# Altium schematic sheet mainSchem.SchDoc
size Tabloid
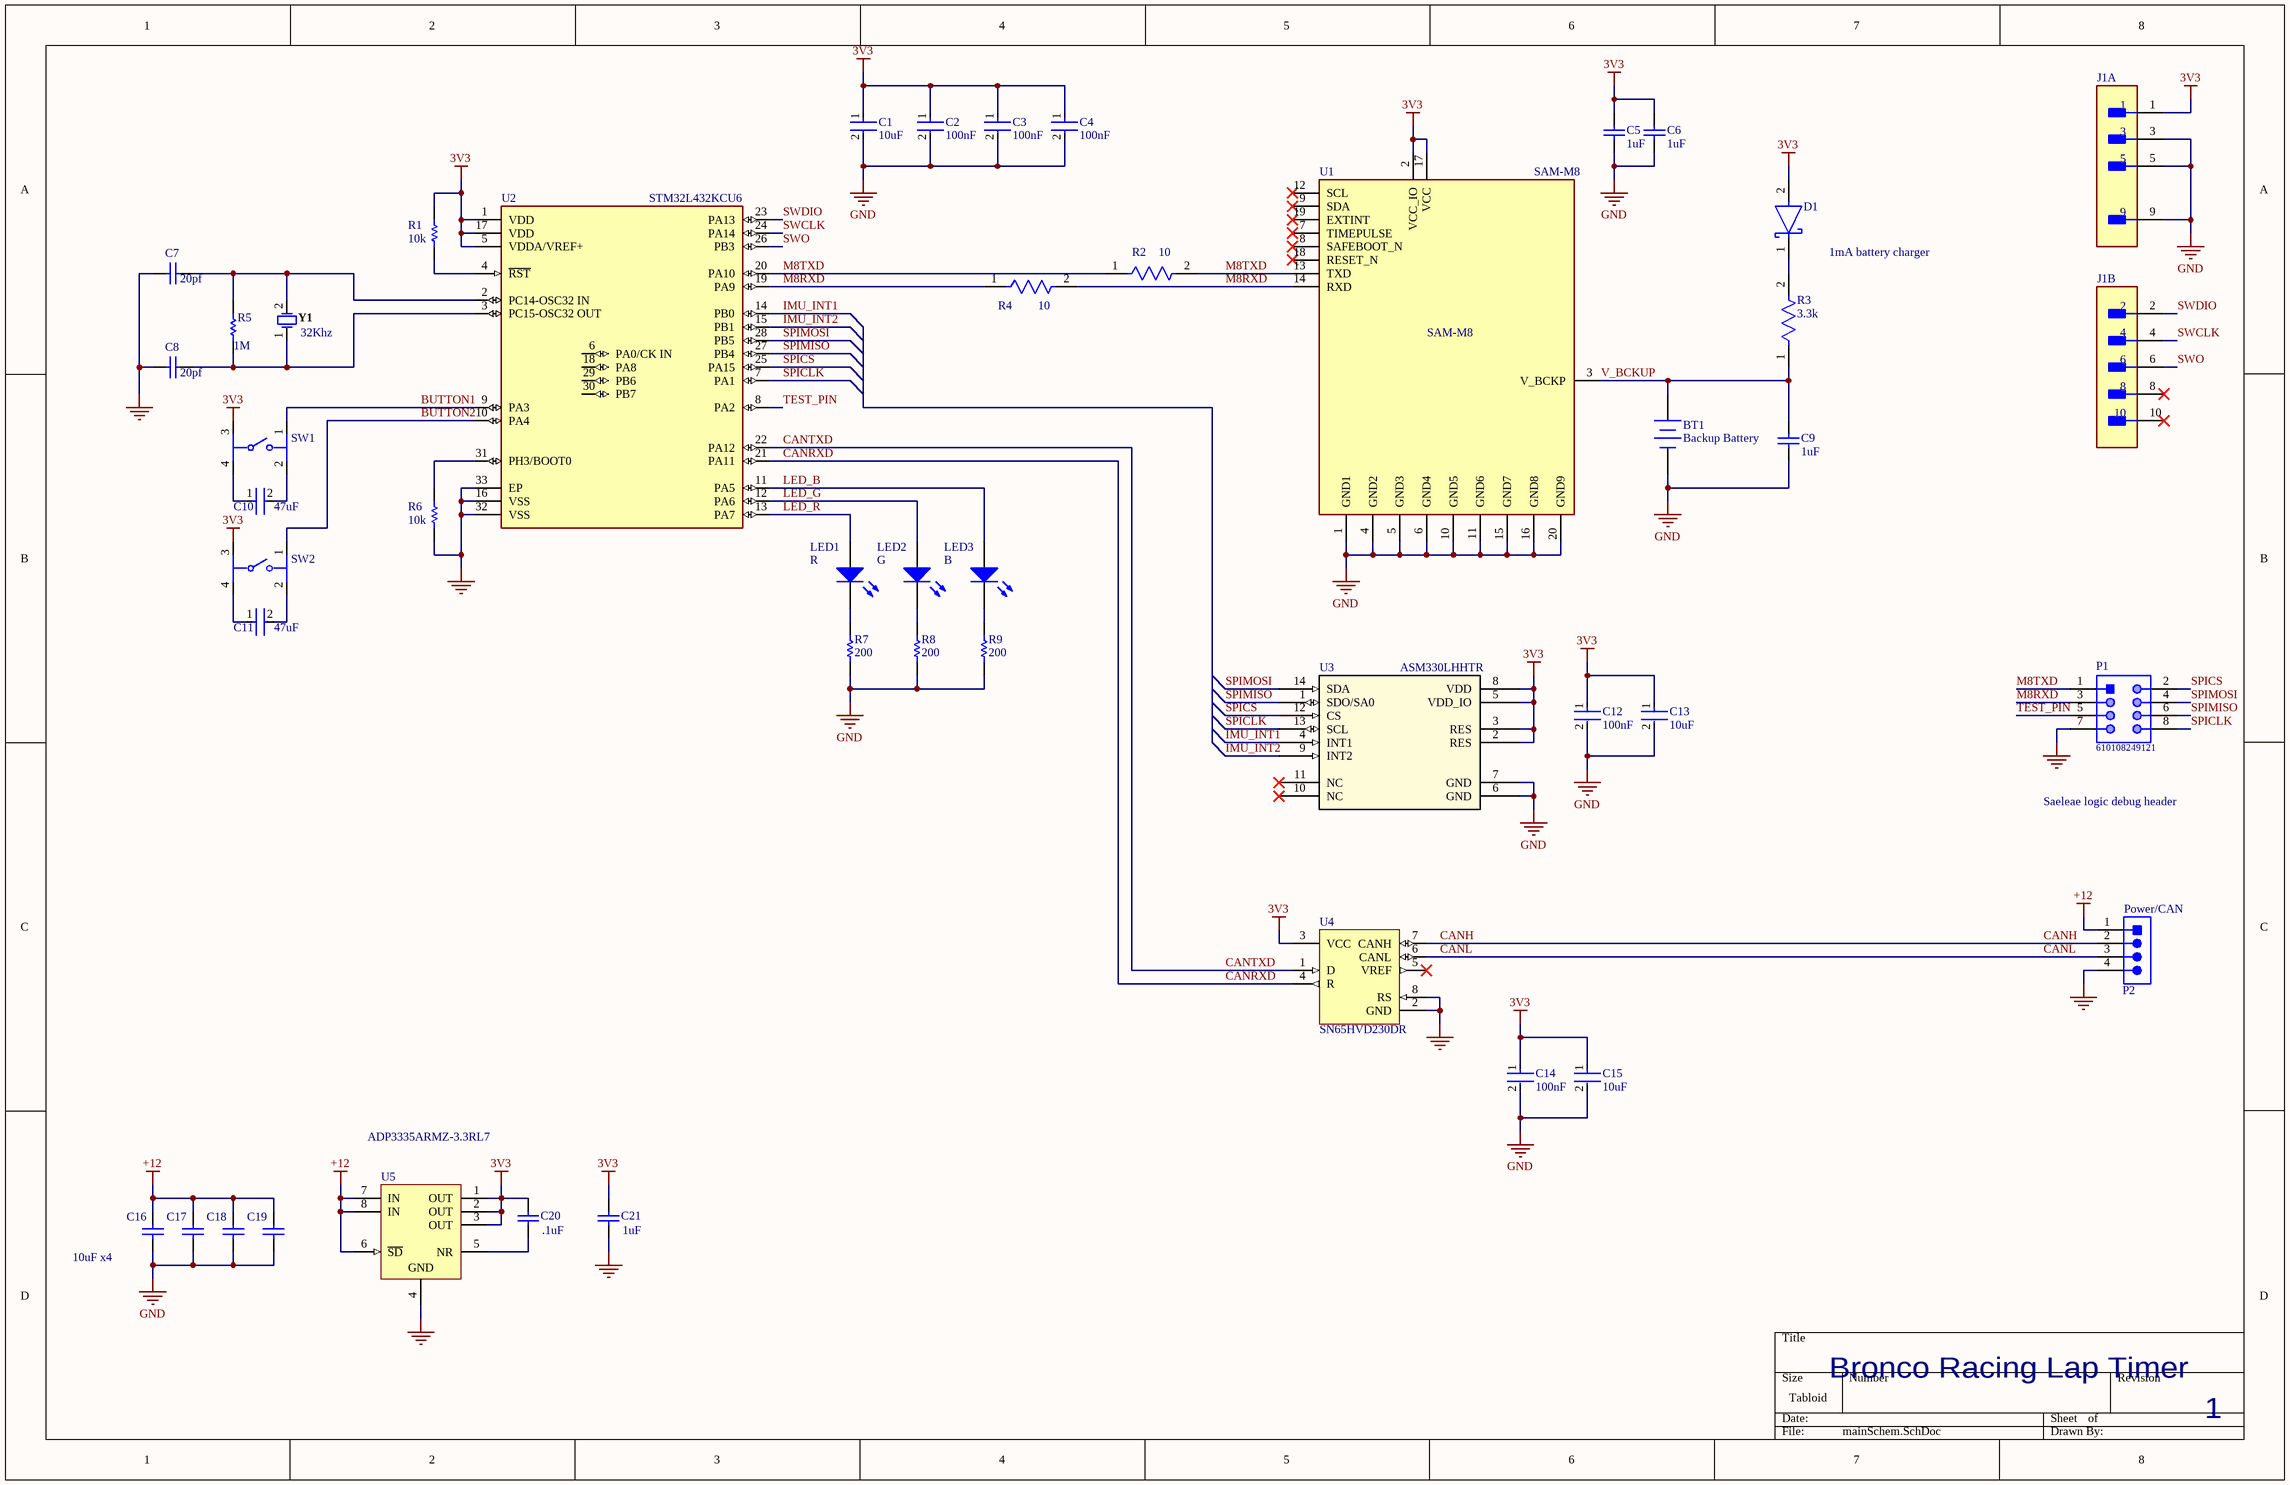
[diagram p0: mainSchem.SchDoc]

## Parts
BT1  Backup Battery  [SEIK-MS621FE-FL11E-2_V]
C1  10uF  [FP-C1608-080-MFG]
C2  100nF  [FP-CGA3E-0_3-0_1-IPC_A]
C3  100nF  [FP-CGA3E-0_3-0_1-IPC_A]
C4  100nF  [FP-CGA3E-0_3-0_1-IPC_A]
C5  1uF  [CAPC1608X90X35LL15T15]
C6  1uF  [CAPC1608X90X35LL15T15]
C7  08051A200JAT2A  [CAPC2013X140X50NL20T25]  (value not drawn)
C8  08051A200JAT2A  [CAPC2013X140X50NL20T25]  (value not drawn)
C9  1uF  [CAPC1608X90X35LL15T15]
C10  47uF  [FP-GRM188-0_2-IPC_B]
C11  47uF  [FP-GRM188-0_2-IPC_B]
C12  100nF  [FP-CGA3E-0_3-0_1-IPC_A]
C13  10uF  [FP-C1608-080-MFG]
C14  100nF  [FP-CGA3E-0_3-0_1-IPC_A]
C15  10uF  [FP-C1608-080-MFG]
C16  CGA5L3X5R1H106K160AB  [CAPC3216X190X20LL20]  (value not drawn)
C17  CGA5L3X5R1H106K160AB  [CAPC3216X190X20LL20]  (value not drawn)
C18  CGA5L3X5R1H106K160AB  [CAPC3216X190X20LL20]  (value not drawn)
C19  CGA5L3X5R1H106K160AB  [CAPC3216X190X20LL20]  (value not drawn)
C20  CGA3E2X7R1H104K080AA  [CAPC1608X90X20LL10]  (value not drawn)
C21  GRM31MR71H105KA88L  [CAPC3216X125X55LL15T25]  (value not drawn)
D1  SD0603S040S0R2  [FP-SD0603-MFG]  (value not drawn)
J1  FTSH-105-01-L-DV-007-K  [FP-FTSH-105-01-L-DV-007-K-MFG]  (value not drawn)  (parts A,B of 2)
LED1  150120RS75000  [1206_A]  (value not drawn)
LED2  150120GS75000  [1206_A]  (value not drawn)
LED3  150120BS75000  [1206_A]  (value not drawn)
P1  610108249121  [610108249121]
P2  B4B-PH-K-S(LF)(SN)  [JST-B4B-PH-K-S_V]  (value not drawn)
R1  10k  [RESC1609X55X30LL15T15]
R2  10  [FP-RT0603-MFG]
R3  3.3k  [FP-RT0603-MFG]
R4  10  [FP-RT0603-MFG]
R5  ERJ-8ENF1004V  [RESC3216X70X50NL05T20]  (value not drawn)
R6  10k  [RESC1609X55X30LL15T15]
R7  200  [RESC1609X55X30NL10T20]
R8  200  [RESC1609X55X30NL10T20]
R9  200  [RESC1609X55X30NL10T20]
SW1  PTS645SM43SMTR92LFS  [FP-PTS645SM43SMTR92LFS-MFG]  (value not drawn)
SW2  PTS645SM43SMTR92LFS  [FP-PTS645SM43SMTR92LFS-MFG]  (value not drawn)
U1  SAM-M8  [SAM-M8]
U2  STM32L432KCU6  [FP-UFQFPN32-A0B8-MFG]
U3  ASM330LHHTR  [LGA-14L_2P5X3X0P83_STM]
U4  SN65HVD230DR  [D0008A_L]
U5  ADP3335ARMZ-3.3RL7  [ADI-RM-8_L]
Y1  ABS07-120-32.768KHZ-T  [ABRA-ABS07_A_V]  (value not drawn)

## Nets
3V3: C1.1 C2.1 C3.1 C4.1 C5.2 C6.2 C12.1 C13.1 C14.1 C15.1 C20.1 C21.1 D1.2(A) J1.1 R1.1 SW1.3 SW2.3 U1.2(VCC_IO) U1.17(VCC) U2.1(VDD) U2.5(VDDA/VREF+) U2.17(VDD) U3.2(RES) U3.3(RES) U3.5(VDD_IO) U3.8(VDD) U4.3(VCC) U5.1(OUT) U5.2(OUT) U5.3(OUT)
+12: C16.1 C17.1 C18.1 C19.1 P2.1 U5.6(~{SD}) U5.7(IN) U5.8(IN)
GND: BT1.2(-) C1.2 C2.2 C3.2 C4.2 C5.1 C6.1 C7.1 C8.1 C9.1 C12.2 C13.2 C14.2 C15.2 C16.2 C17.2 C18.2 C19.2 C21.2 J1.3 J1.5 J1.9 P1.7 P2.4 R6.2 R7.1 R8.1 R9.1 U1.1(GND1) U1.4(GND2) U1.5(GND3) U1.6(GND4) U1.10(GND5) U1.11(GND6) U1.15(GND7) U1.16(GND8) U1.20(GND9) U2.16(VSS) U2.32(VSS) U2.33(EP) U3.6(GND) U3.7(GND) U4.2(GND) U4.8(RS) U5.4(GND)
BUTTON1: SW1.1 U2.9(PA3)
BUTTON2: SW2.1 U2.10(PA4)
CANH: P2.2 U4.7(CANH)
CANL: P2.3 U4.6(CANL)
CANRXD: U2.21(PA11) U4.4(R)
CANTXD: U2.22(PA12) U4.1(D)
IMU_INT1: U2.14(PB0) U3.4(INT1)
IMU_INT2: U2.15(PB1) U3.9(INT2)
LED_B: LED3.2(A) U2.11(PA5)
LED_G: LED2.2(A) U2.12(PA6)
LED_R: LED1.2(A) U2.13(PA7)
M8RXD: P1.3 R4.1 R4.2 U1.14(RXD) U2.19(PA9)
M8TXD: P1.1 R2.1 R2.2 U1.13(TXD) U2.20(PA10)
SPICLK: P1.8 U2.7(PA1) U3.13(SCL)
SPICS: P1.2 U2.25(PA15) U3.12(CS)
SPIMISO: P1.6 U2.27(PB4) U3.1(SDO/SA0)
SPIMOSI: P1.4 U2.28(PB5) U3.14(SDA)
SWCLK: J1.4 U2.24(PA14)
SWDIO: J1.2 U2.23(PA13)
SWO: J1.6 U2.26(PB3)
TEST_PIN: P1.5 U2.8(PA2)
V_BCKUP: BT1.1(+) C9.2 R3.1 U1.3(V_BCKP)
NetC7_2: C7.2 R5.1 U2.2(PC14-OSC32_IN) Y1.2
NetC8_2: C8.2 R5.2 U2.3(PC15-OSC32_OUT) Y1.1
NetC10_1: C10.1 SW1.4
NetC10_2: C10.2 SW1.2
NetC11_1: C11.1 SW2.4
NetC11_2: C11.2 SW2.2
NetC20_2: C20.2 U5.5(NR)
NetD1_1: D1.1(C) R3.2
NetLED1_1: LED1.1(K) R7.2
NetLED2_1: LED2.1(K) R8.2
NetLED3_1: LED3.1(K) R9.2
NetR1_2: R1.2 U2.4(~{RST})
NetR6_1: R6.1 U2.31(PH3/BOOT0)

Not connected (* = marked no-connect by the designer): J1 8* 10*; U1 7(TIMEPULSE)* 8(SAFEBOOT_N)* 9(SDA)* 12(SCL)* 18(RESET_N)* 19(EXTINT)*; U2 6(PA0/CK_IN) 18(PA8) 29(PB6) 30(PB7); U3 10(NC)* 11(NC)*; U4 5(VREF)*

## Notes on the sheet
- (near C7) 20pf
- 1mA battery charger
- (near R5) 1M
- (near Y1) 32Khz
- (near C8) 20pf
- (near LED1) R
- G
- B
- Saeleae logic debug header
- (near P2) Power/CAN
- (near C20) .1uF
- (near C21) 1uF
- (near C16) 10uF x4
- Bronco Racing Lap Timer
- 1

## Library data of the parts
BT1 = CMP-2000-05342-1: MS Lihium Rechargeable Battery, 3 V, -20 to 60 degC, Tray; Manufacturer: SeikoInstruments; Brand: SeikoInstrumentsMicroEnergy; Output Voltage: 3V; Capacity: 5.5mAh; Chemistry: Lithium; Battery Size: 621; Unit Weight: 0.008113oz; Datasheet URL: http://datasheet.octopart.com/MS621FE-FL11E-Seiko-datasheet-5320152.pdf; Rechargeable/Non-Rechargeable: Rechargeable; Orientation: Vertical; Height: 2.1mm; Series: MS; Datasheet Version: Jan-08; Type: CoinCellBatterywithLeads; Diameter: 6.8mm; Mounting Style: WithLeads; Product Category: CoinCellBattery; Termination Style: ThroughHole; Packaging: Tray; Manufacturer URL: http://www.sii.co.jp/en/; RoHS: NotApplicable; Factory Pack Quantity: 100
C1 C13 C15 = CMP-2000-04979-2: CAP CER 10UF 10V X5R 0603; Manufacturer Part Number: C1608X5R1A106K080AC; Manufacturer: TDK; Temperature Coefficient: 15%; Tolerance: 10%; Description: 10µF ±10% 10V Ceramic Capacitor X5R 0603 (1608 Metric); Material: Ceramic; Mouser Description: CAP CER 10UF 10V X5R 0603; Package: C1608-080; Lead Free: Yes; Device Class L1: Passive Components; Value: 10uF; Temperature Range High: +85°C; Octopart: https://octopart.com/c1608x5r1a106k080ac-tdk-26013468; Voltage: 10V; Footprint Url: https://product.tdk.com/info/en/catalog/spec/mlccspec_commercial_general_midvoltage_en.pdf; Ipc Land Pattern Name: CAPC16080X80; Temperature Range Low: -55°C; Temperature: -55°C to +85°C; ComponentLink2Description: Datasheet; ComponentLink2URL: https://product.tdk.com/info/en/documents/chara_sheet/C1608X5R1A106K080AC.pdf; Height: 0.9mm; Temperature Characteristic: X5R; RoHS: TRUE; Category: Cap; Capacitance: 10uF; Digikey Description: CAP CER 10UF 10V X5R 0603; Automotive: No; Device Class L3: Ceramic Capacitors; Device Class L2: Capacitors; Voltage Rating: 10V
C2-C4 C12 C14 = CMP-2000-07546-2: Cap Ceramic 100nF 50V X7R 10% Pad SMD 0603 +125°C Automotive T/R; Weight: 7.1E-05oz; Composition: Ceramic; Max Operating Temperature: 125°C; Termination: SMD/SMT; Dielectric: X7R; Length: 1.6mm; Package Quantity: 1; REACH SVHC: No SVHC; Lead Free: Lead Free; Case Code (Metric): 1608; Min Operating Temperature: -55°C; Packaging: Tape and Reel; Tolerance: 10%; Voltage Rating: 50V; Case Code (Imperial): 0603; Capacitance: 100nF; Case/Package: 0603; Voltage Rating (DC): 50V; Depth: 0.8mm; Radiation Hardening: No; Ratings: AEC-Q200; Mount: Surface Mount; Voltage: 50V; Thickness: 0.035inch; Width: 0.8mm; Height: 0.8mm
C5 C6 C9 = CMP-2006-02216-2: Manufacturer: Kemet; Part Number: C0603C105K3PAC7867
C7 C8 = CMP-2007-04537-1: Manufacturer: AVX Interconnect / Elco; Part Number: 08051A200JAT2A
C10 C11 = CMP-2000-05444-2: Chip Multilayer Ceramic Capacitors for General Purpose, 0603, 47uF, X5R, 15%, 20%, 6.3V; Voltage Rating (DC): 6.3V; Thickness: 0.039inch; Case Code (Imperial): 0603; Packaging: Tape and Reel; Capacitance: 47uF; Width: 0.031inch; Dielectric: X5R; Max Operating Temperature: 85°C; Mount: Surface Mount; Case Code (Metric): 1608; Length: 0.063inch; Voltage Rating: 6.3V; Tolerance: 20%; Case/Package: 0603; Min Operating Temperature: -55°C
C16-C19 = CMP-2000-07597-1: Chip Capacitor, 10 uF, +/- 10%, 50 V, -55 to 85 degC, 1206 (3216 Metric), RoHS, Tape and Reel; Manufacturer: TDK; Dielectric: X5R; Voltage Rating: 50V; Capacitance: 10uF; Width: 1.6mm; Termination: SMD/SMT; Depth: 1.6mm; Package Reference: 1206; Package Quantity: 1; Lead Free: LeadFree; Max Operating Temperature: 85degC; Weight: 0.000571oz; Mounting Technology: SurfaceMount; Case Code (Imperial): 1206; Thickness: 0.063inch; Voltage Rating (DC): 50V; Case Code (Metric): 3216; RoHSCompliant: True; Packaging: TapeandReel; REACH SVHC: NoSVHC; Case/Package: 1206; Min Operating Temperature: -55degC; Manufacturer URL: http://www.tdk.com/; Datasheet Version: 01/2016; Length: 3.2mm; Radiation Hardening: No; Height: 1.6mm; Tolerance: 10%; Composition: Ceramic; Datasheet URL: https://product.tdk.com/info/en/documents/chara_sheet/CGA5L3X5R1H106K160AB.pdf; Package Description: 2-Pin Surface Mount Device, Body 3.2 x 1.6 mm; Mount: SurfaceMount
C20 = CMP-2000-07546-1: Chip Capacitor, 0.1 uF, +/- 10%, 50 V, -55 to 125 degC, 0603 (1608 Metric), RoHS, Tape and Reel; Manufacturer: TDK; Capacitance: 100nF; Voltage: 50V; Dielectric: X7R; Package Reference: 603; Radiation Hardening: No; Composition: Ceramic; Datasheet URL: https://product.tdk.com/info/en/catalog/datasheets/mlcc_automotive_general_en.pdf; Mounting Technology: SurfaceMount; Datasheet Version: 12/2014; Width: 0.8mm; Length: 1.6mm; Tolerance: 10%; Case Code (Imperial): 0603; RoHSCompliant: True; Min Operating Temperature: -55degC; Package Description: 2-Pin Surface Mount Device, Body 1.6 x 0.8 mm; Packaging: TapeandReel; Package Quantity: 1; Voltage Rating: 50V; Mount: SurfaceMount; Lead Free: LeadFree; Depth: 0.8mm; Termination: SMD/SMT; Case Code (Metric): 1608; Thickness: 0.035inch; Height: 0.8mm; Weight: 7.1E-05oz; Voltage Rating (DC): 50V; REACH SVHC: NoSVHC; Manufacturer URL: http://www.tdk.com/; Case/Package: 0603; Max Operating Temperature: 125degC
C21 = CMP-2000-06356-1: Chip Capacitor, 1 uF, +/- 10%, 50 V, -55 to 125 degC, 1206 (3216 Metric), RoHS, Tape and Reel; Manufacturer: Murata; Case Width: 1.6mm; Dielectric: X7R; Case Length: 3.2mm; Case Height: 1.15mm; Voltage Rating DC: 50V; Capacitance: 1uF; Type: GeneralPurposeMLCC; Brand: MurataElectronics; Product: GeneralTypeMLCCs; Factory Pack Quantity: 3000; Packaging: Reel; Case Code - mm: 3216; Datasheet Version: 03/2016; Manufacturer URL: http://www.murata.com/; Tolerance: 10%; Case Code - in: 1206; Product Category: MultilayerCeramicCapacitorsMLCC-SMD/SMT; Series: GRM; Package Description: 2-Pin Surface Mount Device, Body 3.2 x 1.6 mm; Mounting Technology: SurfaceMount; Maximum Operating Temperature: +125C; RoHS: Details; Minimum Operating Temperature: -55C; Package Reference: 1206; Datasheet URL: http://search.murata.co.jp/Ceramy/image/img/A01X/G101/ENG/GRM31MR71H105KA88-01.pdf; Package / Case: 1206(3216metric); Termination Style: SMD/SMT
D1 = CMP-04549-000001-1: DIODE SCHOTTKY 40V 200MA 0603; Manufacturer: AVX; Max Surge Forward Current: 2A; Forward Current: 0.2A; Lead Free: Yes; Reverse Voltage: 40V; Temperature Range Low: -55°C; Device Class L1: Discrete Semiconductors; Category: Diode; ComponentLink2URL: http://datasheets.avx.com/schottky.pdf; Device Class L3: Schottky Diodes; Automotive: No; Temperature Range High: +125°C; Digikey Description: DIODE SCHOTTKY 40V 200MA 0603; Device Class L2: Diodes; ComponentLink2Description: Datasheet; Max Repetitive Reverse Voltage: 40V; Mouser Description: Schottky Diodes & Rectifiers 40volts 0.2A SIZE 0603; Height: 0.86mm; Temperature: -55°C to +125°C; Manufacturer Part Number: SD0603S040S0R2; Package: SD0603; RoHS: TRUE; Octopart: https://octopart.com/sd0603s040s0r2-avx-24931763
J1 = CMP-02766-000093-1: CONN HEADER SMD 10POS 1.27MM; Manufacturer: Samtec; Number Of Contacts: 9; Standoff Height: 0.2mm; Current Rating: 3.4A; Conn Orientation: Vertical; Conn Gender: Male; Device Class L3: unset; Manufacturer Part Number: FTSH-105-01-L-DV-007-K; Mouser Description: Conn Unshrouded Header HDR 10 POS 1.27mm Solder ST SMD Tube; Height: 6.38mm; RoHS: TRUE; Number Of Rows: 2; Footprint Url: http://suddendocs.samtec.com/prints/ftsh-1xx-xx-xxx-dv-xxx-footprint.pdf; Lead Free: Yes; Package: 0; Category: Conn; ComponentLink2URL: http://suddendocs.samtec.com/catalog_english/ftsh_smt.pdf; Automotive: No; ComponentLink2Description: Datasheet; Device Class L1: Connectors; Temperature: -55°C to +125°C; Digikey Description: CONN HEADER SMD 10POS 1.27MM; Device Class L2: Headers and Wire Housings; Temperature Range High: +125°C; Octopart: https://octopart.com/ftsh-105-01-l-dv-007-k-samtec-53647300; Contact Material: Gold,Nickel; Temperature Range Low: -55°C; Pitch: 1.27mm
LED1 = CMP-1426-00013-1: SMD mono-color Chip LED, WL-SMCW, Red; Manufacturer: Wuerth Elektronik; Color: Red; ComponentLink2URL: http://katalog.we-online.com/led/datasheet/150120RS75000.pdf; ComponentLink2Description: Datasheet; ComponentLink1Description: Manufacturer URL; ComponentLink1URL: http://www.we-online.com; PartNumber: 150120RS75000; PackageReference: 1206_A
LED2 = CMP-1426-00014-1: SMD mono-color Chip LED, WL-SMCW, Green; Manufacturer: Wuerth Elektronik; PackageReference: 1206_A; PartNumber: 150120GS75000; ComponentLink1Description: Manufacturer URL; ComponentLink2URL: http://katalog.we-online.com/led/datasheet/150120GS75000.pdf; ComponentLink2Description: Datasheet; Color: Green; ComponentLink1URL: http://www.we-online.com
LED3 = CMP-1426-00015-1: SMD mono-color Chip LED, WL-SMCW, Blue; Manufacturer: Wuerth Elektronik; ComponentLink2Description: Datasheet; ComponentLink1URL: http://www.we-online.com; PartNumber: 150120BS75000; ComponentLink1Description: Manufacturer URL; ComponentLink2URL: http://katalog.we-online.com/led/datasheet/150120BS75000.pdf; PackageReference: 1206_A; Color: Blue
P1 = CMP-1502-01147-1: SMT Angled Pin Header WR-PHD, Pitch 2.54 mm, Dual Row, 8 pins; Manufacturer: Wurth Elektronik; Pitch: 2.54mm; Working Voltage: 250VAC; Rated Current: 3A; Pin Number: 8; Gender: Male; Contact Resistance: 20mOhm; Withstanding Voltage: 600VAC; Row Number: Dual; Operating Temperature: -40to105degC; Part Number: 610108249121; Publisher: WurthElektronik; Datasheet URL: https://katalog.we-online.de/em/datasheet/6101xx249121.pdf; Package Reference: 610108249121; Manufacturer URL: http://www.we-online.de; Orientation: Angled; Mounting Technology: SMT; Packaging: TapeandReel
P2 = CMP-2000-05165-1: Male Header, Pitch 2 mm, 1 x 4 Position, Height 6 mm, Tail Length 3.4 mm, -25 to 85 degC, RoHS, Bulk; Manufacturer: JST; No of Positions: 4; Style/Orientation: StraightHeader/Plug; Pitch: 2mm; Datasheet URL: http://datasheet.octopart.com/B4B-PH-K-S%28LF%29%28SN%29-JST-datasheet-10558886.pdf; Type: ShroudedHeader; Manufacturer URL: http://www.jst.com/home2.html; Termination: Crimp; Datasheet Version: Apr-09
R1 R6 = CMP-2000-07452-1: Chip Resistor, 10 KOhm, +/- 1%, 0.1 W, -55 to 155 degC, 0603 (1608 Metric), RoHS, Tape and Reel; Manufacturer: Panasonic; Voltage Rating: 75V; Case\/Package: 0603; Power Rating: 100mW; Resistance: 10KOhm; Temperature Coefficient: 100ppm\/degreesC; Number of Pins: 2; Package Reference: 603; Depth: 0.8mm; Mount: SurfaceMount; Package Description: 2-Pin Surface Mount Device, Body 1.6 x 0.85 mm; Datasheet Version: 02/2017; Length: 1.6mm; Lead Free: LeadFree; Height: 0.45mm; Number of Terminations: 2; Max Power Dissipation: 100mW; Min Operating Temperature: -55degC; Datasheet URL: https://industrial.panasonic.com/cdbs/www-data/pdf/RDA0000/AOA0000C304.pdf; Termination: SMD/SMT; Case Code (Metric): 1608; Case Code (Imperial): 0603; Tolerance: 1%; Max Operating Temperature: 155degC; RoHSCompliant: true; Voltage Rating (DC): 75V; Radiation Hardening: No; Packaging: TapeandReel; Composition: ThickFilm; Mounting Technology: SurfaceMount; Manufacturer URL: http://www.panasonic.com/; Width: 0.031inch; REACH SVHC: NoSVHC; Contact Plating: Tin; Military Standard: Not; Package Quantity: 1
R2 R4 = CMP-2000-04347-2: RES SMD 10 OHM 0.1% 1/10W 0603; Manufacturer: Yageo; Manufacturer Part Number: RT0603BRD0710RL; Resistance: 10Ω; Temperature Coefficient: 25 ppm/°C; Power Rating: 0.1W; Tolerance: 0.001; Voltage Rating: 75V; Value: 10Ω; Description: RT0603 10Ω 0.1W 25 ppm/°C 0.10%; Height: 0.55mm; Temperature Range Low: -55°C; Temperature Range High: +155°C; Package: RT0603; Digikey Description: RES SMD 10 OHM 0.1% 1/10W 0603; Lead Free: Yes; Ipc Land Pattern Name: RESC16080X45; Mouser Description: Thin Film Resistors - SMD 1/10W 10 ohm .1% 25ppm; Automotive: No; Footprint Url: http://www.yageo.com/exep/pages/download/literatures/PYu-R_Mount_10.pdf; Series: RT; Device Class L3: Chip SMD Resistors; Device Class L2: Resistors; Octopart: https://octopart.com/rt0603brd0710rl-yageo-1216748; Temperature: -55°C to +155°C; Composition: Thin Film; Category: Res; ComponentLink2Description: Datasheet; Device Class L1: Passive Components; RoHS: TRUE; ComponentLink2URL: http://www.yageo.com/documents/recent/PYu-RT_1-to-0.01_RoHS_L_9.pdf
R3 = CMP-03412-033968-1: RES 3.30K OHM 1/10W 1% SMD 0603; Manufacturer Part Number: RT0603FRE073K3L; Manufacturer: Yageo; Voltage Rating: 75V; Power Rating: 0.1W; Temperature Coefficient: 50 ppm/°C; Value: 3.3KΩ; Tolerance: 0.01; Description: RT0603 3.3KΩ 0.1W 50 ppm/°C 1.00%; Category: Res; Device Class L2: Resistors; Series: RT; Octopart: https://octopart.com/rt0603fre073k3l-yageo-39814754; Package: RT0603; Temperature Range High: +155°C; Automotive: No; Temperature: -55°C to +155°C; Device Class L1: Passive Components; ComponentLink2URL: http://www.yageo.com/documents/recent/PYu-RT_1-to-0.01_RoHS_L_9.pdf; Height: 0.55mm; Digikey Description: RES 3.30K OHM 1/10W 1% SMD 0603; Lead Free: Yes; Resistance: 3.3KΩ; Mouser Description: High Precision-High Stability Chip Resistor Thin Film 0603 3.3kOhm 1% Paper T/R; ComponentLink2Description: Datasheet; Footprint Url: http://www.yageo.com/exep/pages/download/literatures/PYu-R_Mount_10.pdf; Ipc Land Pattern Name: RESC16080X45; Temperature Range Low: -55°C; RoHS: TRUE; Device Class L3: Chip SMD Resistors; Composition: Thin Film
R5 = CMP-2003-00020-1: Manufacturer: Panasonic; Part Number: ERJ-8ENF1004V
R7-R9 = CMP-2000-03727-1: Part Number: TNPW0603200RBEEA; Manufacturer: Vishay Dale
SW1 SW2 = CMP-2000-05160-2: SWITCH TACTILE SPST-NO 0.05A 12V; Contact Resistance: 100mR; Throw Configuration: SPST; Illumination Type: Non-Illuminated; Mechanical Life: 100000Cycles; Current Rating: 50mA; Switch Function: Off-Mom; Actuator Length: 0.85mm; Actuator Material: Nylon; Actuator Type: Standard; Operating Force: 160gf; Min Operating Temperature: -20°C; REACH SVHC: No SVHC; Termination: Gull Wing; Case/Package: SMD/SMT; Packaging: Tape and Reel; Mount: Surface Mount; Voltage Rating (DC): 12V; Orientation: Straight; Lead Free: Lead Free; Contact Material: Silver; Color: Black; Max Current Rating: 50mA; Contact Plating: Silver; Depth: 9mm; Package Quantity: 1; Max Voltage Rating (DC): 12V; Length: 6mm; Max Operating Temperature: 60°C
U1 = SAM-M8: u-blox SAM GNSS antenna module; Manufacturer: u-blox; Part Description: u-blox SAM GNSS antenna module; Value: SAM-M8
U2 = CMP-12105-000033-1: IC MCU 32BIT 256KB FLASH 32QFPN; Manufacturer: STMicroelectronics; Max Supply Voltage: 3.6V; Number Of Timers/Counters: 11; Ram Size: 64KBytes; Number Of Usb Channels: 1; Memory Size: 256KBytes; Number Of Uart Channels: 3; Frequency: 80MHz; Number Of I2C Channels: 2; Core Architecture: ARM Cortex-M4; Number Of I/Os: 26; Min Supply Voltage: 1.62V; Data Bus Width: 32bits; Max Junction Temp: +105°C; Interface: I2C,SPI,UART,USART,CAN,USB,LIN,IrDA,Other; Ambient Temperature Range High: +85°C; Category: IC; Device Class L2: Embedded Processors and Controllers; Ambient Temperature Range Low: -40°C; Number Of Adc Channels: 11; ComponentLink2Description: Datasheet; Number Of A/D Converters: 1; Device Class L1: Integrated Circuits (ICs); Memory Type: FLASH; Height: 0.6mm; Temperature: -40°C to +105°C; Automotive: No; Temperature Range Low: -40°C; Digikey Description: IC MCU 32BIT 256KB FLASH 32QFPN; Manufacturer Part Number: STM32L432KCU6; Temperature Range High: +105°C; Octopart: https://octopart.com/stm32l432kcu6-stmicroelectronics-71093510; Device Class L3: Microcontrollers; Number Of Pwm Channels: 1; Number Of Spi Channels: 2; Lead Free: Yes; Number Of Cores: 1; Package: UFQFPN32-A0B8; ComponentLink2URL: https://www.st.com/content/ccc/resource/technical/document/datasheet/24/01/9f/59/f0/83/47/fc/DM00257205.pdf/files/DM00257205.pdf/jcr:content/translations/en.DM00257205.pdf; RoHS: TRUE
U3 = ASM330LHHTR: No Description Available; Vendor: STMicroelectronics; Built_By: EMA_Cory; SourceLibrary: Updates_to_database_2020-11-03; Datasheet: https://www.st.com/resource/en/datasheet/asm330lhh.pdf; Manufacturer_Part_Number: ASM330LHHTR; Copyright: Copyright (C) 2018 Accelerated Designs. All rights reserved; RefDes: RefDes; Type: DEV
U4 = CMP-0315-00015-2: 3.3V CAN Transceiver with Standby Mode, 17 mA, -40 to 85 degC, 8-pin SOIC (D), Green (RoHS & no Sb/Br); Manufacturer: Texas Instruments; Rating: Catalog; Transient Pulse Protection(V): -25 to 25; Receivers Per Package: 1; ICC(Max)(mA): 17; Supply Voltage(s)(V): 3.3; Low Power Mode: Standby; Mounting Technology: Surface Mount; PackageReference: D0008A; Footprint: PCA82C250; ComponentLink1URL: http://www.ti.com/general/docs/lit/getliterature.tsp?genericPartNumber=SN65HVD230&fileType=pdf; Code_JEDEC: MS-012AA; ComponentLink1Description: Datasheet; Eco-Plan: Green (RoHS & no Sb/Br); PartNumber: SN65HVD230DR; PackageDescription: 8-Pin Plastic Small Outline Integrated Circuit, 4.9 x 3.9 mm, Pitch 1.27 mm Pitch; Isolated: No; DatasheetVersion: SLOS346K; PackageVersion: revM, Jun-2011; SubFamily: CAN; Drivers Per Package: 1
U5 = CMP-0786-00245-1: High Accuracy, Ultralow IQ, 500 mA, anyCAP Low Dropout Regulator, 2.6 to 12 V Vin, 3.3 V Vout, Industrial, 8-pin SOP (RM-8), Reel; Manufacturer: Analog Devices; Vin (max) (V): 12; Vin (min) (V): 2.6; ComponentLink4URL: Product URL:http://www.analog.com/en/ADP3335/productSearch.html; PackageDescription: 8-Pin Mini Small Outline Package, Body 3 x 3 mm, Pitch 0.65 mm; PackageVersion: Aug-05; ComponentLink1Description: Manufacturer URL; ComponentLink1URL: http://www.analog.com/en/index.html; ComponentLink3Description: Package Specification; DatasheetVersion: Rev. C; ComponentLink3URL: http://www.analog.com/static/imported-files/packages/PKG_PDF/MSOP%28RM%29/RM_8.pdf; ComponentLink2URL: http://www.analog.com/static/imported-files/data_sheets/ADP3335.pdf; ComponentLink2Description: Datasheet; ComponentLink4Description: URL Link1; PartNumber: ADP3335ARMZ-3.3RL7; PackageReference: RM-8; Packing: Reel; Code_JEDEC: MO-187-AA; Mounting Technology: Surface Mount
Y1 = CMP-2000-07587-1: Tuning Fork Crystal, 32.768 KHz, +/- 20 ppm, -40 to 85 degC, 2-Pin SMD, RoHS, Tape and Reel; Manufacturer: Abracon; Case\/Package: SMD/SMT; Series Resistance: 60KOhm; Frequency Tolerance: 20ppm; Load Capacitance: 6pF; ESR (Equivalent Series Resistance): 55KOhm; Max Operating Temperature: 85degC; Width: 0.061inch; Radiation Hardening: No; Lead Free: LeadFree; RoHSCompliant: True; Depth: 1.5mm; Datasheet URL: http://www.abracon.com/Resonators/ABS07-120-32.768kHz-T.pdf; Frequency: 32.768KHz; Termination: SMD/SMT; Manufacturer URL: http://www.abracon.com/; Package Quantity: 3000; Packaging: TapeandReel; Number of Pins: 2; Height: 0.035inch; Package Description: 2-Pin Surface Mount Device, Body 3.2 x 1.5 mm; Package Reference: ABS07; Mount: SurfaceMount; Tolerance: 20ppm; Mounting Technology: SurfaceMount; REACH SVHC: NoSVHC; Datasheet Version: 11/2014; Length: 3.2mm; Min Operating Temperature: -40degC